# Altium project ESP_SENSOR_STATION_REV1.PrjPcb
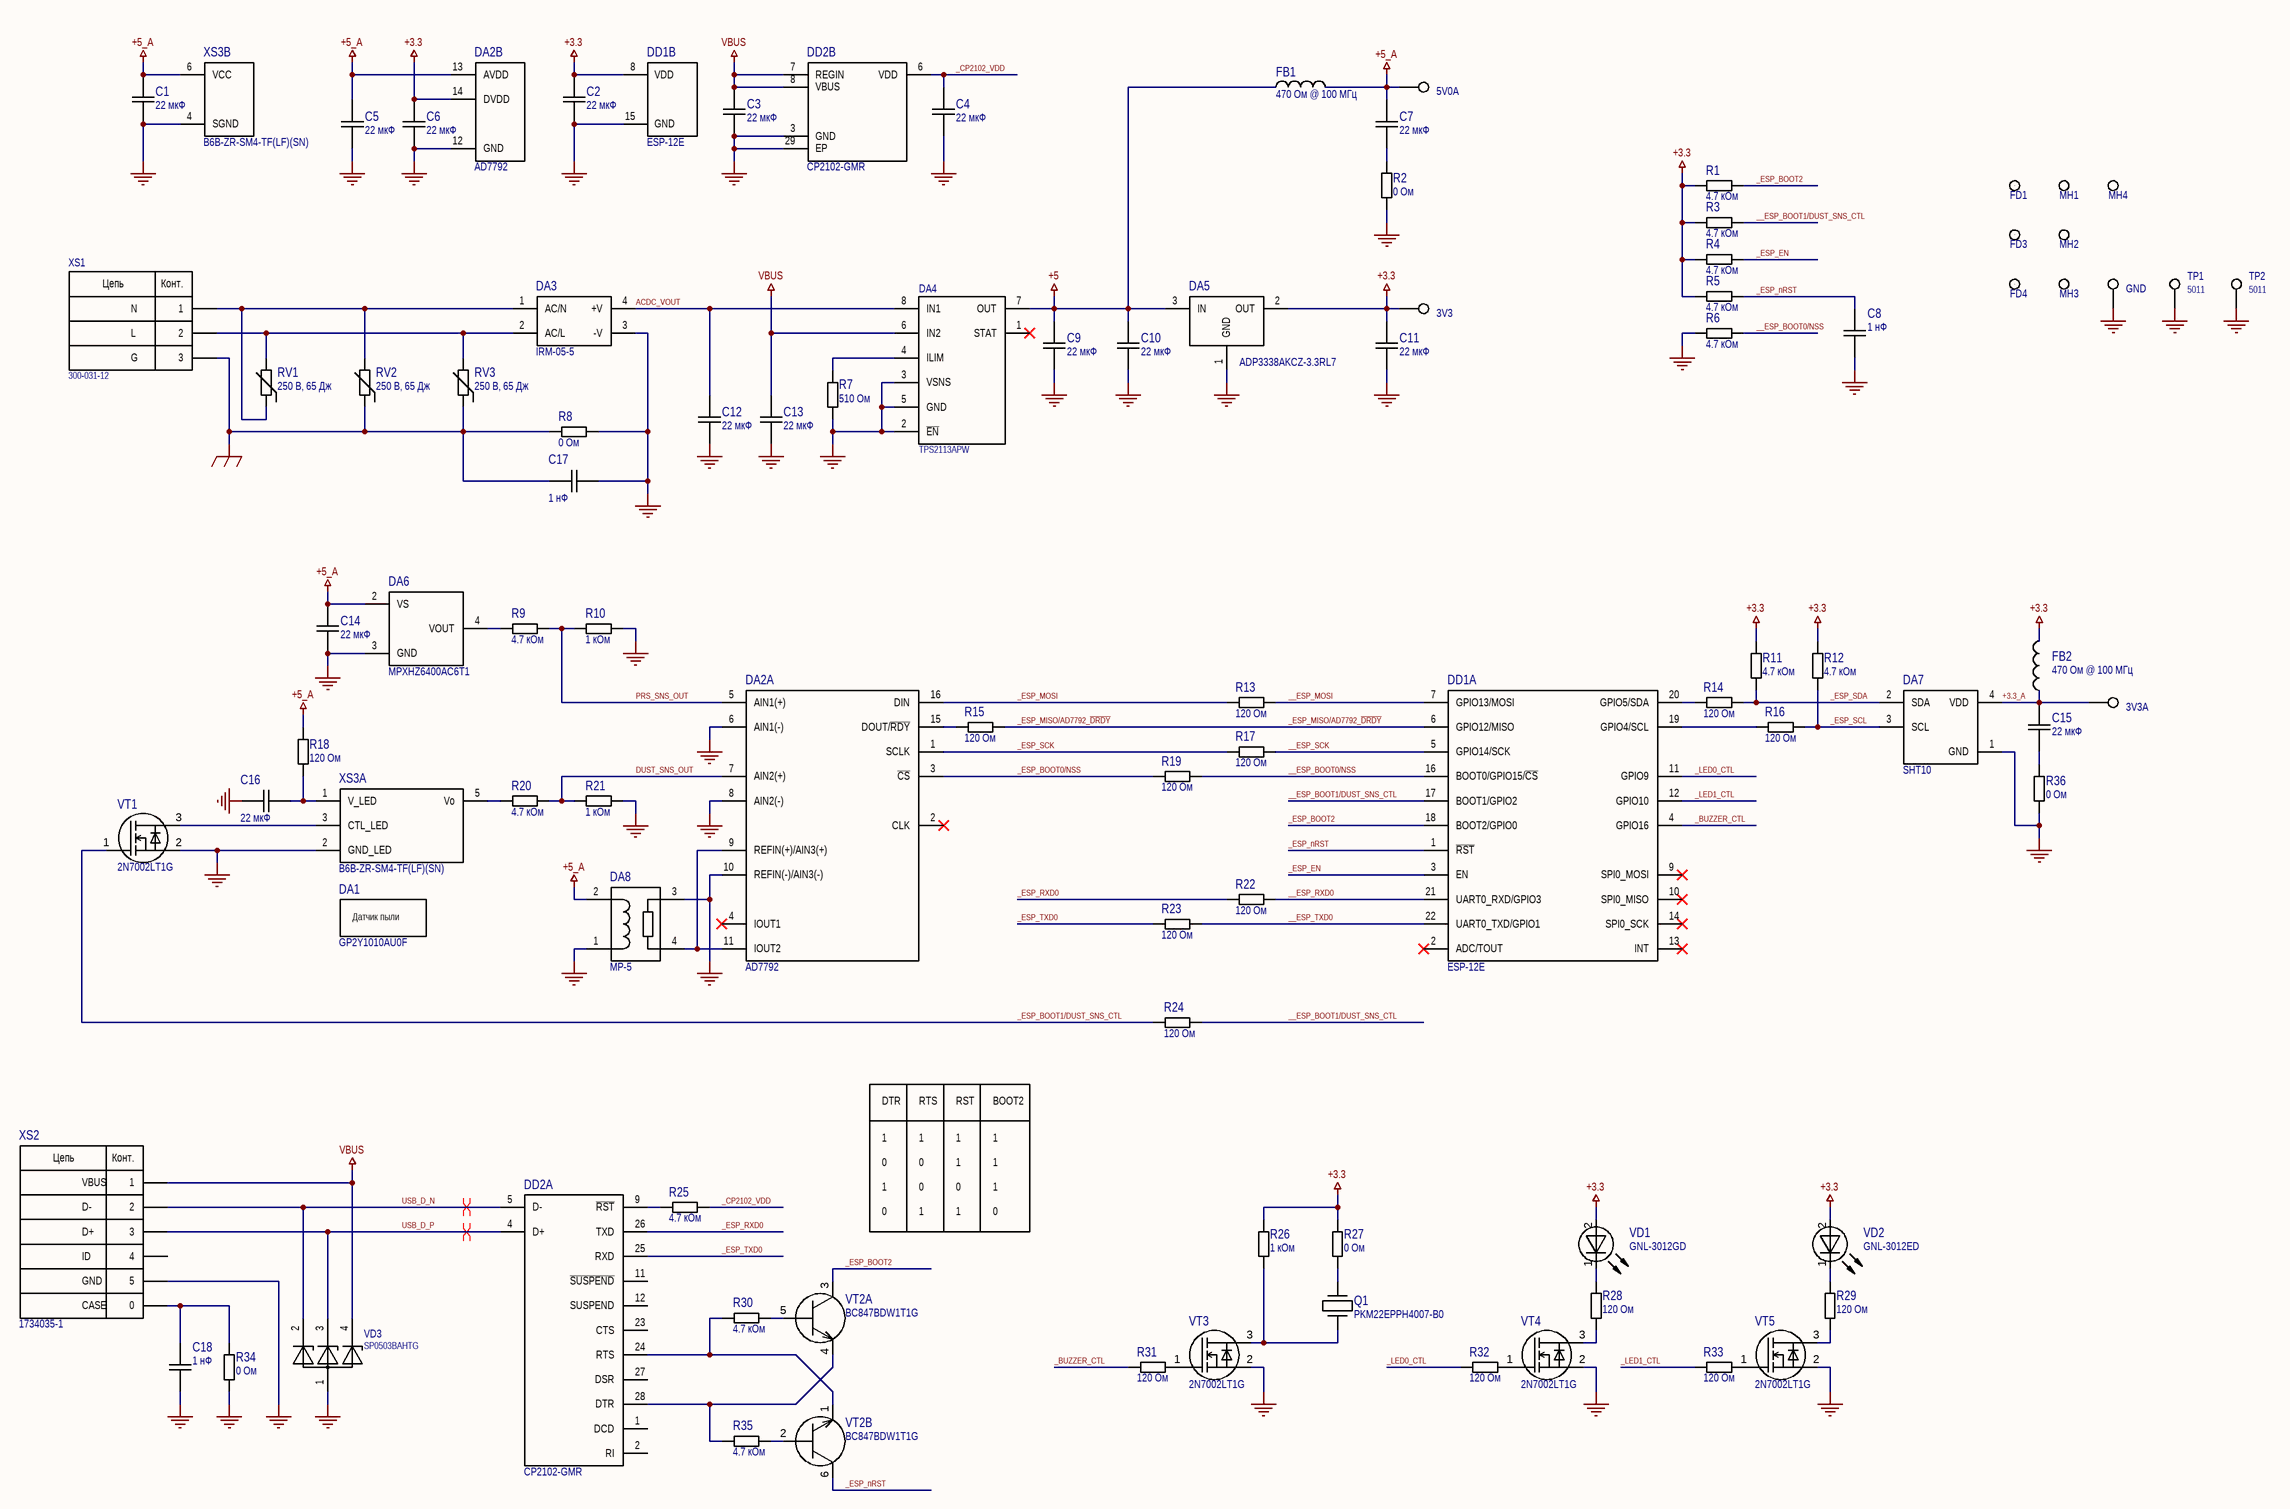
[diagram p0: ESP_SENSOR_STATION_REV1.SchDoc]
1 sheet, 94 parts. Net scope: hierarchical (ports join the sheet entries above them; power ports are global).
Board file: ESP_SENSOR_STATION_REV1.PcbDoc

## Sheet ESP_SENSOR_STATION_REV1.SchDoc
size 594 x 420 mm; Address1: Address1; Address2: Address2; Address3: Address3; Address4: Address4; Revision: REV1; SheetNumber: 1; Scale: 1:1; Разраб.: Марикова; Обозначение документа: ИУ4.11.04.03.19 - 22.12.01 ЭЗ; Пров.: Шпиев; Номер листа: 1; Общее количество листов: 1; Литера: О; Наименование организации: кафедра ИУ4, группа ИУ4-22М; Наименование изделия 1: Датчик системы зонного; Наименование изделия 2: Схема электрическая; Наименование изделия 3: принципиальная; Нач. отд.: Нач.сект.; Наименование организации1: МГТУ им. Н. Э. Баумана,; Наименование изделия 1.1: контроля внешних условий

### Parts
3V3  _TESTPOINT  [_TESTPOINT]  (value not drawn)  (no BOM)
3V3A  _TESTPOINT  [_TESTPOINT]  (value not drawn)  (no BOM)
5V0A  _TESTPOINT  [_TESTPOINT]  (value not drawn)  (no BOM)
C1  22 мкФ  [CAPC1608X08N]
C2  22 мкФ  [CAPC1608X08N]
C3  22 мкФ  [CAPC1608X08N]
C4  22 мкФ  [CAPC1608X08N]
C5  22 мкФ  [CAPC1608X08N]
C6  22 мкФ  [CAPC1608X08N]
C7  22 мкФ  [CAPC1608X08N]
C8  1 нФ  [CAPC1608X08N]
C9  22 мкФ  [CAPC1608X08N]
C10  22 мкФ  [CAPC1608X08N]
C11  22 мкФ  [CAPC1608X08N]
C12  22 мкФ  [CAPC1608X08N]
C13  22 мкФ  [CAPC1608X08N]
C14  22 мкФ  [CAPC1608X08N]
C15  22 мкФ  [CAPC1608X08N]
C16  22 мкФ  [CAPC1608X08N]
C17  1 нФ  [CAPC1608X08N]
C18  1 нФ  [CAPC1608X08N]
DA1  GP2Y1010AU0F  [GP2Y1010AU0F]
DA2  AD7792  [TSOP65P640X120-16N]  (parts A,B of 2)
DA3  IRM-05-5  [IRM-05]
DA4  TPS2113APW  [TSOP65P640X120-8N]
DA5  ADP3338AKCZ-3.3RL7  [SOT230P700X180-4N]
DA6  MPXHZ6400AC6T1  [MPXHZ6400AC6T1]
DA7  SHT10  [SHT1x]
DA8  MP-5  [MP-5]
DD1  ESP-12E  [ESP-12E]  (parts A,B of 2)
DD2  CP2102-GMR  [QFN50P500X500X100_HS-29N]  (parts A,B of 2)
FB1  470 Ом @ 100 МГц  [INDC1608X08N]
FB2  470 Ом @ 100 МГц  [INDC1608X08N]
FD1  _FIDUCIAL  [_FIDUCIAL]  (value not drawn)  (no BOM)
FD3  _FIDUCIAL  [_FIDUCIAL]  (value not drawn)  (no BOM)
FD4  _FIDUCIAL  [_FIDUCIAL]  (value not drawn)  (no BOM)
GND  _TESTPOINT  [_TESTPOINT]  (value not drawn)  (no BOM)
MH1  _MOUNTING_HOLE_M3  [_MOUNTING_HOLE_M3]  (value not drawn)  (no BOM)
MH2  _MOUNTING_HOLE_M3  [_MOUNTING_HOLE_M3]  (value not drawn)  (no BOM)
MH3  _MOUNTING_HOLE_M3  [_MOUNTING_HOLE_M3]  (value not drawn)  (no BOM)
MH4  _MOUNTING_HOLE_M3  [_MOUNTING_HOLE_M3]  (value not drawn)  (no BOM)
Q1  PKM22EPPH4007-B0  [PKM22EPPH4007-B0]
R1  4.7 кОм  [RESC1608X06N]
R2  0 Ом  [RESC1608X06N]
R3  4.7 кОм  [RESC1608X06N]
R4  4.7 кОм  [RESC1608X06N]
R5  4.7 кОм  [RESC1608X06N]
R6  4.7 кОм  [RESC1608X06N]
R7  510 Ом  [RESC1608X06N]
R8  0 Ом  [RESC1608X06N]
R9  4.7 кОм  [RESC1608X06N]
R10  1 кОм  [RESC1608X06N]
R11  4.7 кОм  [RESC1608X06N]
R12  4.7 кОм  [RESC1608X06N]
R13  120 Ом  [RESC1608X06N]
R14  120 Ом  [RESC1608X06N]
R15  120 Ом  [RESC1608X06N]
R16  120 Ом  [RESC1608X06N]
R17  120 Ом  [RESC1608X06N]
R18  120 Ом  [RESC1608X06N]
R19  120 Ом  [RESC1608X06N]
R20  4.7 кОм  [RESC1608X06N]
R21  1 кОм  [RESC1608X06N]
R22  120 Ом  [RESC1608X06N]
R23  120 Ом  [RESC1608X06N]
R24  120 Ом  [RESC1608X06N]
R25  4.7 кОм  [RESC1608X06N]
R26  1 кОм  [RESC1608X06N]
R27  0 Ом  [RESC1608X06N]
R28  120 Ом  [RESC1608X06N]
R29  120 Ом  [RESC1608X06N]
R30  4.7 кОм  [RESC1608X06N]
R31  120 Ом  [RESC1608X06N]
R32  120 Ом  [RESC1608X06N]
R33  120 Ом  [RESC1608X06N]
R34  0 Ом  [RESC1608X06N]
R35  4.7 кОм  [RESC1608X06N]
R36  0 Ом  [RESC1608X06N]
RV1  250 В, 65 Дж  [B72214S0251K101]
RV2  250 В, 65 Дж  [B72214S0251K101]
RV3  250 В, 65 Дж  [B72214S0251K101]
TP1  5011  [5011]
TP2  5011  [5011]
VD1  GNL-3012GD  [GNL-3012GD]
VD2  GNL-3012ED  [GNL-3012ED]
VD3  SP0503BAHTG  [SOT190P237X122-4N]
VT1  2N7002LT1G  [SOT95P237X111-3N]
VT2  BC847BDW1T1G  [SOT65P210X110-6N]  (parts A,B of 2)
VT3  2N7002LT1G  [SOT95P237X111-3N]
VT4  2N7002LT1G  [SOT95P237X111-3N]
VT5  2N7002LT1G  [SOT95P237X111-3N]
XS1  300-031-12  [300-031-12]
XS2  1734035-1  [1734035-1]
XS3  B6B-ZR-SM4-TF(LF)(SN)  [B6B-ZR-SM4-TF(LF)(SN)]  (parts A,B of 2)

### Nets
+3.3: 3V3.1 C2.2 C6.2 C11.2 DA2.14(DVDD) DA5.2(OUT) DD1.8(VDD) FB2.2 R1.1 R3.1 R4.1 R5.1 R11.1 R12.1 R26.2 R27.2 VD1.2(A) VD2.2(A)
+5: C9.2 C10.2 DA4.7(OUT) DA5.3(IN) FB1.1
+5_A: 5V0A.1 C1.2 C5.2 C7.2 C14.2 DA2.13(AVDD) DA6.2(VS) DA8.2 FB1.2 R18.1 XS3.6(VCC)
GND: C1.1 C2.1 C3.1 C4.1 C5.1 C6.1 C8.1 C9.1 C10.1 C11.1 C12.1 C13.1 C14.1 C16.1 C17.1 C18.2 DA2.6(AIN1(-)) DA2.8(AIN2(-)) DA2.10(REFIN(-)/AIN3(-)) DA2.12(GND) DA3.3(-V) DA4.2(~{EN}) DA4.3(VSNS) DA4.5(GND) DA5.1(GND) DA6.3(GND) DA7.1(GND) DA8.1 DA8.3 DD1.15(GND) DD2.3(GND) DD2.29(EP) GND.1 R2.2 R6.1 R7.1 R8.1 R10.1 R21.1 R34.1 R36.2 TP1.1 TP2.1 VD3.1 VT1.2(S) VT3.2(S) VT4.2(S) VT5.2(S) XS2.5 XS3.2(GND_LED) XS3.4(SGND)
PGND: C17.2 R8.2 RV2.1 RV3.1 XS1.3
VBUS: C3.2 C13.2 DA4.6(IN2) DD2.7(REGIN) DD2.8(VBUS) VD3.4 XS2.1
+3.3_A: 3V3A.1 C15.2 DA7.4(VDD) FB2.1
__ESP_BOOT0/NSS: DD1.16(BOOT0/GPIO15/~{CS}) R6.2 R19.1
__ESP_BOOT1/DUST_SNS_CTL: DD1.17(BOOT1/GPIO2) R3.2 R24.1
__ESP_MOSI: DD1.7(GPIO13/MOSI) R13.1
__ESP_RXD0: DD1.21(UART0_RXD/GPIO3) R22.1
__ESP_SCK: DD1.5(GPIO14/SCK) R17.1
__ESP_TXD0: DD1.22(UART0_TXD/GPIO1) R23.1
_BUZZER_CTL: DD1.4(GPIO16) R31.2
_CP2102_VDD: C4.2 DD2.6(VDD) R25.1
_ESP_BOOT0/NSS: DA2.3(~{CS}) R19.2
_ESP_BOOT1/DUST_SNS_CTL: R24.2 VT1.1(G)
_ESP_BOOT2: DD1.18(BOOT2/GPIO0) R1.2 VT2.3(C1)
_ESP_EN: DD1.3(EN) R4.2
_ESP_MISO/AD7792_~{DRDY}: DD1.6(GPIO12/MISO) R15.1
_ESP_MOSI: DA2.16(DIN) R13.2
_ESP_nRST: C8.2 DD1.1(~{RST}) R5.2 VT2.6(C2)
_ESP_RXD0: DD2.26(TXD) R22.2
_ESP_SCK: DA2.1(SCLK) R17.2
_ESP_SCL: DA7.3(SCL) R12.2 R16.1
_ESP_SDA: DA7.2(SDA) R11.2 R14.1
_ESP_TXD0: DD2.25(RXD) R23.2
_LED0_CTL: DD1.11(GPIO9) R32.2
_LED1_CTL: DD1.12(GPIO10) R33.2
ACDC_VOUT: C12.2 DA3.4(+V) DA4.8(IN1)
DUST_SNS_OUT: DA2.7(AIN2(+)) R20.2 R21.2
PRS_SNS_OUT: DA2.5(AIN1(+)) R9.2 R10.2
USB_D_N: DD2.5(D-) VD3.2 XS2.2
USB_D_P: DD2.4(D+) VD3.3 XS2.3
NetC7_1: C7.1 R2.1
NetC15_1: C15.1 R36.1
NetC16_2: C16.2 R18.2 XS3.1(V_LED)
NetC18_1: C18.1 R34.2 XS2.0
NetDA2_9: DA2.9(REFIN(+)/AIN3(+)) DA2.11(IOUT2) DA8.4
NetDA2_15: DA2.15(DOUT/~{RDY}) R15.2
NetDA3_1: DA3.1(AC/N) RV1.1 RV2.2 XS1.1
NetDA3_2: DA3.2(AC/L) RV1.2 RV3.2 XS1.2
NetDA4_4: DA4.4(ILIM) R7.2
NetDA6_4: DA6.4(VOUT) R9.1
NetDD1_19: DD1.19(GPIO4/SCL) R16.2
NetDD1_20: DD1.20(GPIO5/SDA) R14.2
NetDD2_9: DD2.9(~{RST}) R25.2
NetDD2_24: DD2.24(RTS) R30.1 VT2.1(E2)
NetDD2_28: DD2.28(DTR) R35.1 VT2.4(E1)
NetQ1_1: Q1.1 R26.1 VT3.3(D)
NetQ1_2: Q1.2 R27.1
NetR20_1: R20.1 XS3.5(Vo)
NetR28_1: R28.1 VT4.3(D)
NetR28_2: R28.2 VD1.1(C)
NetR29_1: R29.1 VT5.3(D)
NetR29_2: R29.2 VD2.1(C)
NetR30_2: R30.2 VT2.5(B1)
NetR31_1: R31.1 VT3.1(G)
NetR32_1: R32.1 VT4.1(G)
NetR33_1: R33.1 VT5.1(G)
NetR35_2: R35.2 VT2.2(B2)
NetVT1_3: VT1.3(D) XS3.3(CTL_LED)

Not connected (* = marked no-connect by the designer): DA2 2(CLK)* 4(IOUT1)*; DA4 1(STAT)*; DD1 2(ADC/TOUT)* 9(SPI0_MOSI)* 10(SPI0_MISO)* 13(INT)* 14(SPI0_SCK)*; DD2 1(DCD) 2(RI) 11(~{SUSPEND}) 12(SUSPEND) 23(CTS) 27(DSR); FD1 0; FD3 0; FD4 0; XS2 4

### Layout directives
differential pair; differential pair class USB: USB_D_N, USB_D_P

### Notes on the sheet
- DTR
- 1
- RTS
- RST
- BOOT2
- 0
- (in symbol 300-031-12) Цепь; Конт.; N; L; G
- (in symbol 1734035-1) Цепь; Конт.; VBUS; D-; D+; ID; GND; CASE
- (in symbol GP2Y1010AU0F) Датчик пыли

### Library data of the parts
C1-C7 C9-C16 = GRM188R61A226ME15D
C8 C17 C18 = GRM1885C2A102JA01D
FB1 FB2 = BLM18PG471SN1D
R1 R3-R6 R9 R11 R12 R20 R25 R30 R35 = RC0603FR-074K7L
R2 R8 R27 R34 R36 = RC0603FR-070RL
R7 = RC0603FR-07510RL
R10 R21 R26 = RC0603FR-071KL
R13-R19 R22-R24 R28 R29 R31-R33 = RC0603FR-07120RL
RV1-RV3 = B72214S0251K101